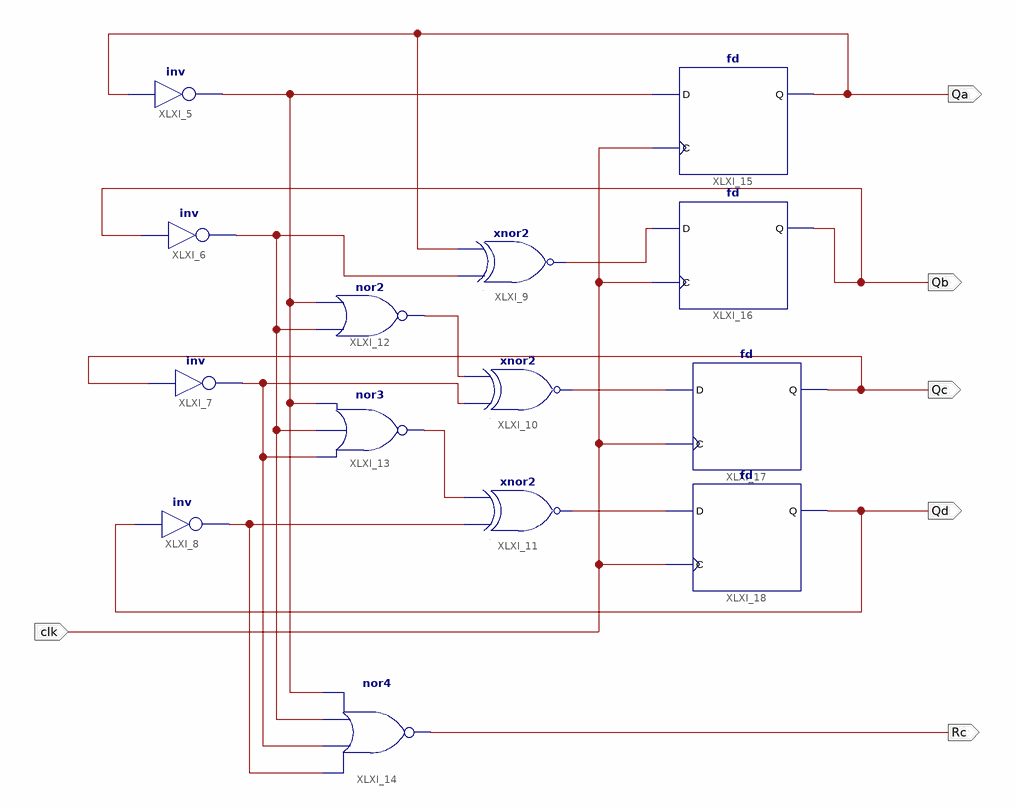
[diagram p0: schematic sheet 1]
// Xilinx ISE schematic Counter4b.sch (kintex7) as structural Verilog: 14 symbols, 6 ports
module Counter4b (
  input  clk,
  output Qb,
  output Qc,
  output Qd,
  output Rc,
  output Qa
);

  wire XLXN_13, XLXN_16, XLXN_20, XLXN_24, XLXN_25, XLXN_26, XLXN_27, XLXN_28, XLXN_52;

  not XLXI_5 (XLXN_13, Qa);
  not XLXI_6 (XLXN_52, Qb);
  not XLXI_7 (XLXN_20, Qc);
  not XLXI_8 (XLXN_28, Qd);
  xnor XLXI_9 (XLXN_27, XLXN_52, Qa);
  xnor XLXI_10 (XLXN_26, XLXN_20, XLXN_16);
  xnor XLXI_11 (XLXN_24, XLXN_28, XLXN_25);
  nor XLXI_12 (XLXN_16, XLXN_52, XLXN_13);
  nor XLXI_13 (XLXN_25, XLXN_20, XLXN_52, XLXN_13);
  nor XLXI_14 (Rc, XLXN_28, XLXN_20, XLXN_52, XLXN_13);
  fd XLXI_15 (.C(clk), .D(XLXN_13), .Q(Qa));
  fd XLXI_16 (.C(clk), .D(XLXN_27), .Q(Qb));
  fd XLXI_17 (.C(clk), .D(XLXN_26), .Q(Qc));
  fd XLXI_18 (.C(clk), .D(XLXN_24), .Q(Qd));
endmodule
